# Altium project Lab5.PrjPcb
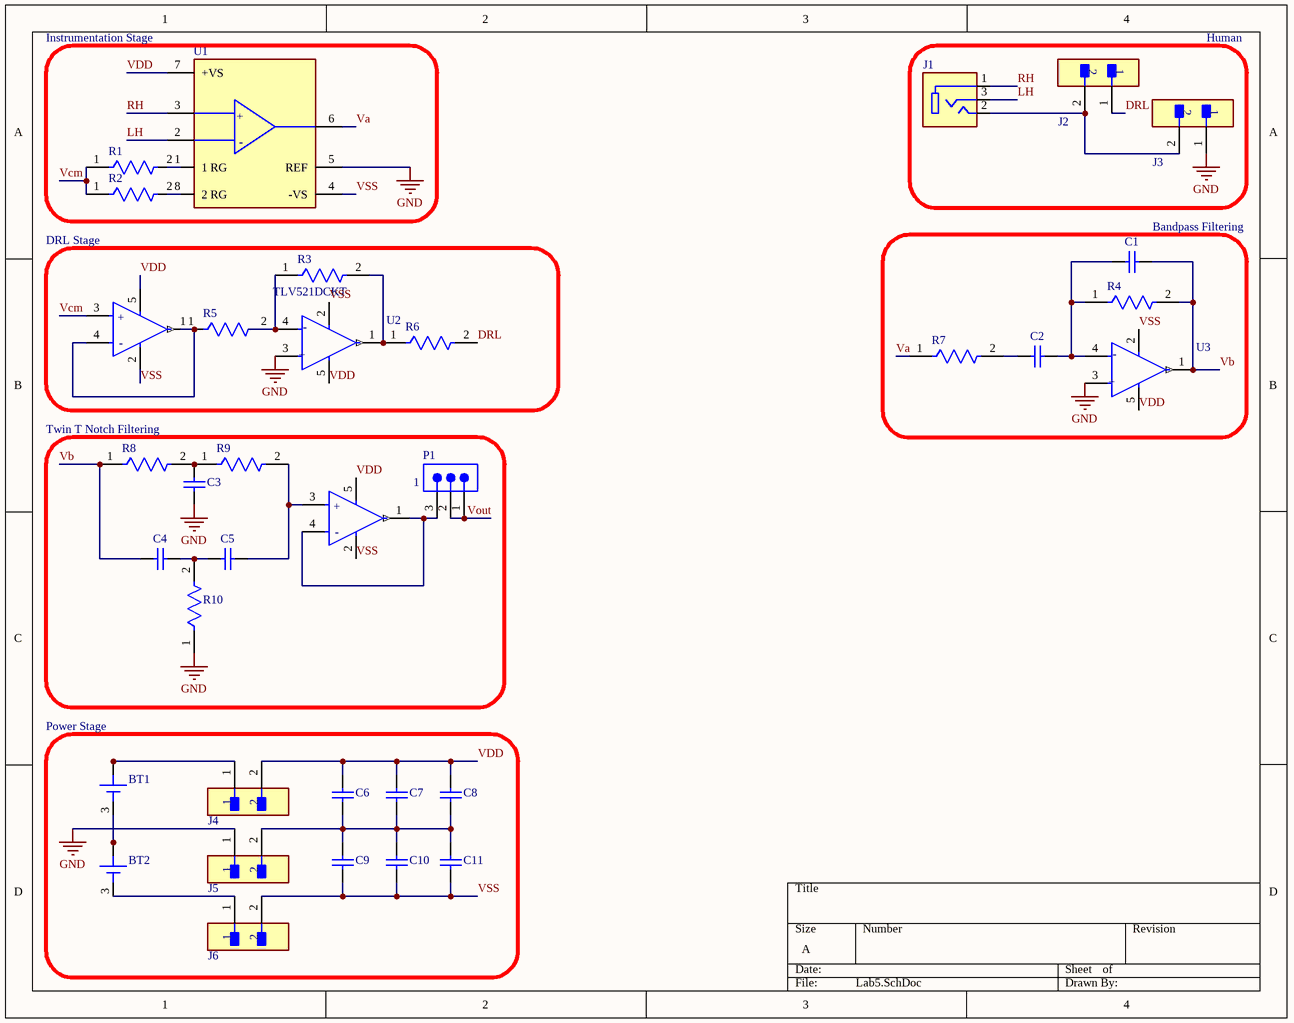
[diagram p0: Lab5.SchDoc]
1 sheet, 35 parts. Net scope: global (net labels, ports and power ports of the same name join across sheets).
Board file: Lab5.PcbDoc

## Sheet Lab5.SchDoc
size A; SheetNumber: 1; SheetTotal: 1

### Parts
1  TLV521DCKT  [FP-DCK0005A-MFG]  (value not drawn)
BT1  BK-913-TR  [BAT_BK-913-TR]  (value not drawn)
BT2  BK-913-TR  [BAT_BK-913-TR]  (value not drawn)
C1  C0805C225K9PACTU  [CAPC2013X145X50ML20T25]  (value not drawn)
C2  C0805C225K9PACTU  [CAPC2013X145X50ML20T25]  (value not drawn)
C3  C0805C225K9PACTU  [CAPC2013X145X50ML20T25]  (value not drawn)
C4  C0805C225K9PACTU  [CAPC2013X145X50ML20T25]  (value not drawn)
C5  C0805C225K9PACTU  [CAPC2013X145X50ML20T25]  (value not drawn)
C6  C0805C225K9PACTU  [CAPC2013X145X50ML20T25]  (value not drawn)
C7  C0805C225K9PACTU  [CAPC2013X145X50ML20T25]  (value not drawn)
C8  C0805C225K9PACTU  [CAPC2013X145X50ML20T25]  (value not drawn)
C9  C0805C225K9PACTU  [CAPC2013X145X50ML20T25]  (value not drawn)
C10  C0805C225K9PACTU  [CAPC2013X145X50ML20T25]  (value not drawn)
C11  C0805C225K9PACTU  [CAPC2013X145X50ML20T25]  (value not drawn)
J1  SJ-3523-SMT-TR  [CUI_SJ-3523-SMT-TR]  (value not drawn)
J2  TSW-102-07-L-S  [FP-TSW-102-07-L-S-MFG]  (value not drawn)
J3  TSW-102-07-L-S  [FP-TSW-102-07-L-S-MFG]  (value not drawn)
J4  TSW-102-07-L-S  [FP-TSW-102-07-L-S-MFG]  (value not drawn)
J5  TSW-102-07-L-S  [FP-TSW-102-07-L-S-MFG]  (value not drawn)
J6  TSW-102-07-L-S  [FP-TSW-102-07-L-S-MFG]  (value not drawn)
P1  TSW-103-07-F-S  [SMTC-TSW-103-07-X-S]  (value not drawn)
R1  CRCW080516K0FKEA  [FP-CRCW0805-e3-IPC_C]  (value not drawn)
R2  CRCW080516K0FKEA  [FP-CRCW0805-e3-IPC_C]  (value not drawn)
R3  CRCW080516K0FKEA  [FP-CRCW0805-e3-IPC_C]  (value not drawn)
R4  CRCW080516K0FKEA  [FP-CRCW0805-e3-IPC_C]  (value not drawn)
R5  CRCW080516K0FKEA  [FP-CRCW0805-e3-IPC_C]  (value not drawn)
R6  CRCW080516K0FKEA  [FP-CRCW0805-e3-IPC_C]  (value not drawn)
R7  CRCW080516K0FKEA  [FP-CRCW0805-e3-IPC_C]  (value not drawn)
R8  CRCW080516K0FKEA  [FP-CRCW0805-e3-IPC_C]  (value not drawn)
R9  CRCW080516K0FKEA  [FP-CRCW0805-e3-IPC_C]  (value not drawn)
R10  CRCW080516K0FKEA  [FP-CRCW0805-e3-IPC_C]  (value not drawn)
U1  AD620ARZ-REEL7  [FP-R-8-IPC_B]  (value not drawn)
U2  TLV521DCKT  [FP-DCK0005A-MFG]
U3  TLV521DCKT  [FP-DCK0005A-MFG]  (value not drawn)
  TLV521DCKT  [FP-DCK0005A-MFG]  (value not drawn)

### Blocks framed on the sheet
Instrumentation Stage: R1 R2 U1
Human: J1-J3
DRL Stage: R3 R5 R6 U2 
Bandpass Filtering: C1 C2 R4 R7 U3
Twin T Notch Filtering: 1 C3-C5 P1 R8-R10
Power Stage: BT1 BT2 C6-C11 J4-J6

### Nets
GND: C3.1 J3.1 J5.1 R10.1 U1.5(REF) U2.3(IN+) U3.3(IN+)
DRL: J2.1 R6.2
LH: J1.3 U1.2(-IN)
RH: J1.1 U1.3(+IN)
Va: R7.1 U1.6(OUTPUT)
Vb: C1.2 C4.1 R4.2 R8.1 U3.1(OUT)
Vcm: R1.1 R2.1 .3(IN+)
VDD: 1.5(V+) C6.2 C7.2 C8.2 J4.2 U1.7(+VS) U2.5(V+) U3.5(V+) .5(V+)
Vout: P1.1 P1.2
VSS: 1.2(V-) C9.1 C10.1 C11.1 J6.2 U1.4(-VS) U2.2(V-) U3.2(V-) .2(V-)
Net1_1: 1.1(OUT) 1.4(IN-) P1.3
Net1_3: 1.3(IN+) C5.2 R9.2
NetBT1_1: BT1.1(POS) BT1.2(POS) J4.1
NetBT1_3: BT1.3(NEG) BT2.1(POS) BT2.2(POS)
NetBT2_3: BT2.3(NEG) J6.1
NetC1_1: C1.1 C2.2 R4.1 U3.4(IN-)
NetC2_1: C2.1 R7.2
NetC3_2: C3.2 R8.2 R9.1
NetC4_2: C4.2 C5.1 R10.2
NetC6_1: C6.1 C7.1 C8.1 C9.2 C10.2 C11.2 J5.2
NetJ1_2: J1.2 J2.2 J3.2
NetR1_2: R1.2 U1.1(1_RG)
NetR2_2: R2.2 U1.8(2_RG)
NetR3_1: R3.1 R5.2 U2.4(IN-)
NetR3_2: R3.2 R6.1 U2.1(OUT)
NetR5_1: R5.1 .1(OUT) .4(IN-)

### Notes on the sheet
- (in symbol CMP-04895-000072-1) +; -
- (in symbol CMP-09116-000354-1) +

### Library data of the parts
1 U2 U3  = CMP-04895-000072-1: IC CMOS 1 CIRCUIT SC70-5; Input Offset Voltage (Vos): 100uV; Output Current per Channel: 12mA; Number of Circuits: 1; Slew Rate: 2.5V/µs; Operating Supply Current: 350nA; Bandwidth: 6kHz; Input Bias Current: 1pA; Mount: Surface Mount; Case/Package: SC; REACH SVHC: No SVHC; Max Operating Temperature: 125°C; Lead Free: Lead Free; Packaging: Cut Tape; Min Operating Temperature: -40°C; Number of Amplifiers: 1; Gain Bandwidth Product: 6kHz; Number of Pins: 5; Number of Channels: 1
BT1 BT2 = BK-913-TR: Battery Retainer Coin, 20.0mm 1 Cell PC Pin; MF: MPD (Memory Protection Devices); SnapEDA_Link: https://www.snapeda.com/parts/BK-913-TR/Memory+Protection+Devices/view-part/?ref=snap; Package: None; Value: *; MP: BK-913-TR; Check_prices: https://www.snapeda.com/parts/BK-913-TR/Memory+Protection+Devices/view-part/?ref=eda
C1-C11 = CMP-1036-04819-2: Manufacturer: Kemet; Part Number: C0805C225K9PACTU
J1 = SJ-3523-SMT-TR: <b>Audio Jack Connector</b> 3.5 mm Low Profile Surface Mount Stereo Jack, 3 Pin Right-Angle; Package: None; MP: SJ-3523-SMT-TR; Value: *; Availability: Unavailable; Price: None
J2-J6 = CMP-02766-001428-1: CONN HEADER VERT 2POS 2.54MM; Voltage Rating: 550V; Current Rating: 7.6A; Gender: Male; Number of Contacts: 2; Connector Type: Male Pin; Radiation Hardening: No; Orientation: Straight; Contact Plating: Gold; Max Operating Temperature: 125°C; Mount: Through Hole; Package Quantity: 1; Number of Rows: 1; Housing Material: Polyester; RoHS Compliant: Yes; Length: 5.08mm; Max Voltage Rating (AC): 550V; Pitch: 2.54mm; Packaging: Bulk; Depth: 2.54mm; Termination: Solder; Min Operating Temperature: -55°C; Housing Color: Black; Lead Free: Lead Free; Color: Black; Number of Positions: 2; Width: 2.54mm; Max Current Rating: 7.6A; REACH SVHC: No SVHC; Contact Material: Bronze; Contact Mating Length: 0.23inch; Series: TSW; Contact Type: Male Pin
P1 = CMP-1024-00331-1: 0.025" SQ Post Header, Through-hole, Vertical, -55 to 125 degC, 2.54 mm Pitch, 3-Pin, Male, RoHS; Manufacturer: Samtec; Pitch: 2.54 mm; DatasheetVersion: F-214; ComponentLink1Description: Manufacturer URL; ComponentLink3URL: http://www.samtec.com/documents/webfiles/cpdf/TSW-XXX-XX-XXX-X-XX-XXX-MKT.pdf; Mounting Technology: Through-hole; PackageDescription: .025[0.64] SQ. Post Terminal Strip Assembly; Temperature Range: -55 to 125 degC; ComponentLink3Description: Package Specification; Orientation: Vertical; PartNumber: TSW-103-07-F-S; RoHS: True; PackageVersion: DM, 8/1988; ComponentLink2Description: Datasheet; ComponentLink1URL: http://www.samtec.com; ComponentLink2URL: http://www.samtec.com/documents/webfiles/pdf/TSW_TH.PDF; PackageReference: TSW-103-07-X-S
R1-R10 = CMP-2001-04979-2: RES Thick Film, 16kΩ, 1%, 0.125W, 100ppm/°C, 0805; Voltage Rating: 150V; Power Rating: 125mW; Resistance: 16kR; Contact Plating: Tin; Case Code (Imperial): 0805; Tolerance: 1%; Weight: 0.000194oz; Height: 0.45mm; Max Power Dissipation: 125mW; Lead Free: Lead Free; Number of Pins: 2; Composition: Thick Film; Package Quantity: 10; Max Operating Temperature: 155°C; Length: 2mm; Width: 1.25mm; Voltage Rating (DC): 150V; Packaging: Tape and Reel; Termination: SMD/SMT; Depth: 1.25mm; Mount: Surface Mount; Temperature Coefficient: 100ppm/°C; Features: Automotive AEC-Q200; Military Standard: Not; Case Code (Metric): 2012; Radiation Hardening: No; Number of Terminations: 2; Min Operating Temperature: -55°C; Case/Package: 0805
U1 = CMP-09116-000354-1: IC INST AMP 1 CIRCUIT 8SOIC; Input Resistance: 10GR; Bandwidth: 800kHz; Dual Supply Voltage: 15V; Number of Channels: 1; Power Dissipation: 650mW; Input Bias Current: 500pA; Common Mode Rejection Ratio: 93dB; Slew Rate: 1.2V/µs; Supply Current: 900uA; Input Offset Voltage (Vos): 30mV; Min Dual Supply Voltage: 2.3V; Min Supply Voltage: 4.6V; Power Supply Rejection Ratio (PSRR): 140dB; Operating Supply Voltage: 18V; Output Current per Channel: 18mA; -3db Bandwidth: 1MHz; Operating Supply Current: 1.3mA; Mount: Surface Mount; RoHS Compliant: Yes; Max Operating Temperature: 125°C; Radiation Hardening: No; Packaging: Tape and Reel; Nominal Supply Current: 900uA; Contact Plating: Tin; Number of Elements: 1; Number of Circuits: 1; Series: -; Case/Package: SOIC; Package Quantity: 1; Max Dual Supply Voltage: 18V; Min Operating Temperature: -55°C; Lead Free: Contains Lead; Number of Pins: 8; Max Power Dissipation: 650mW